# EAGLE schematic ickenham (EAGLE 9.6.2)

## Sheet 1 of 6: USB host controller
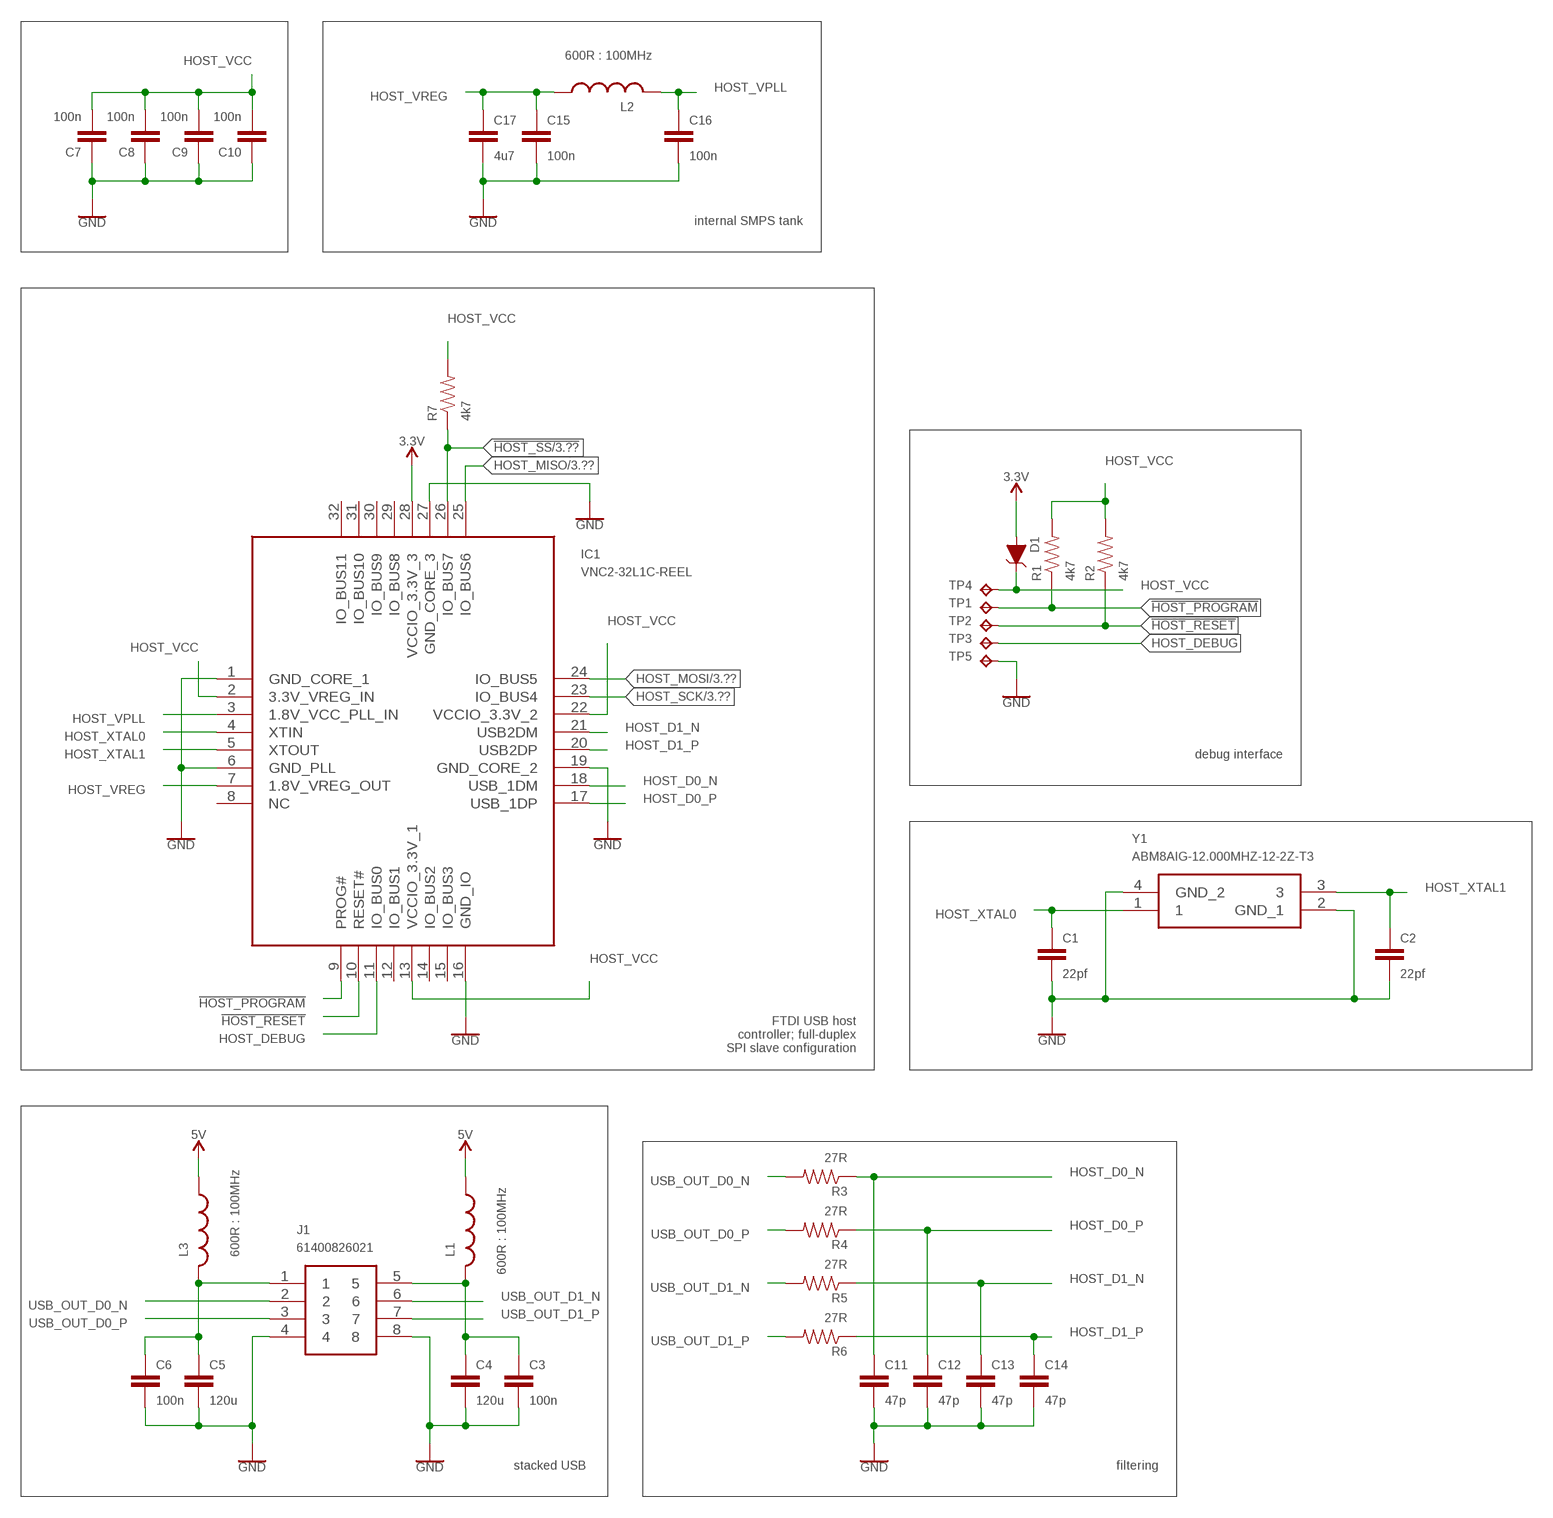
[diagram p0: schematic, sheet 1]

### Parts
C1  22pf  C-EUC0402  [C0402]
C2  22pf  C-EUC0402  [C0402]
C3  100n  CAP0402-CAP  [0402-CAP]
C4  120u  CAP0805  [0805]
C5  120u  CAP0805  [0805]
C6  100n  CAP0402-CAP  [0402-CAP]
C7  100n  C-EUC0402  [C0402]
C8  100n  C-EUC0402  [C0402]
C9  100n  C-EUC0402  [C0402]
C10  100n  C-EUC0402  [C0402]
C11  47p  CAP0402-CAP  [0402-CAP]
C12  47p  CAP0402-CAP  [0402-CAP]
C13  47p  CAP0402-CAP  [0402-CAP]
C14  47p  CAP0402-CAP  [0402-CAP]
C15  100n  CAP0402-CAP  [0402-CAP]
C16  100n  CAP0402-CAP  [0402-CAP]
C17  4u7  CAP0805  [0805]
D1  3.6V  DIODE-ZENER-BZT52C3V6S  [SOD-323]
IC1  VNC2-32L1C-REEL  [QFP80P900X900X160-32N]
J1  61400826021  [DUAL_USB_2.0_TYPE-A]
L1  600R : 100MHz  INDUCTOR0805  [0805]
L2  600R : 100MHz  INDUCTOR0805  [0805]
L3  600R : 100MHz  INDUCTOR0805  [0805]
R1  4k7  RESISTOR0402-RES  [0402-RES]
R2  4k7  RESISTOR0402-RES  [0402-RES]
R3  27R  RESISTOR0805-RES  [0805]
R4  27R  RESISTOR0805-RES  [0805]
R5  27R  RESISTOR0805-RES  [0805]
R6  27R  RESISTOR0805-RES  [0805]
R7  4k7  RESISTOR0402-RES  [0402-RES]
TP1  TPTP10R  [TP10R]
TP2  TPTP10R  [TP10R]
TP3  TPTP10R  [TP10R]
TP4  TPTP10SQ  [TP10SQ]
TP5  TPTP10R  [TP10R]
Y1  ABM8AIG-12.000MHZ-12-2Z-T3  [ABM8AIG25000MHZ122ZT3]

### Nets
3.3V: D1.A IC1.28(VCCIO_3.3V_3) ; also sheet 2,3,4,5,6
5V: L1.1 L3.1 ; also sheet 2,5
!HOST_PROGRAM: IC1.9(PROG#) R1.1 TP1.TP
!HOST_RESET: IC1.10(RESET#) R2.1 TP2.TP
!HOST_SS: IC1.26(IO_BUS7) R7.1 ; also sheet 3
GND: C1.2 C2.2 C3.2 C4.2 C5.2 C6.2 C7.1 C8.1 C9.1 C10.1 C11.2 C12.2 C13.2 C14.2 C15.2 C16.2 C17.2 IC1.1(GND_CORE_1) IC1.6(GND_PLL) IC1.16(GND_IO) IC1.19(GND_CORE_2) IC1.27(GND_CORE_3) J1.4 J1.8 TP5.TP Y1.2(GND_1) Y1.4(GND_2) ; also sheet 2,3,4,5,6
HOST_D0_N: C11.1 IC1.18(USB_1DM) R3.1
HOST_D0_P: C12.1 IC1.17(USB_1DP) R4.1
HOST_D1_N: C13.1 IC1.21(USB2DM) R5.1
HOST_D1_P: C14.1 IC1.20(USB2DP) R6.1
HOST_DEBUG: IC1.11(IO_BUS0) TP3.TP
HOST_MISO: IC1.25(IO_BUS6) ; also sheet 3
HOST_MOSI: IC1.24(IO_BUS5) ; also sheet 3
HOST_SCK: IC1.23(IO_BUS4) ; also sheet 3
HOST_VCC: C7.2 C8.2 C9.2 C10.2 D1.C IC1.2(3.3V_VREG_IN) IC1.13(VCCIO_3.3V_1) IC1.22(VCCIO_3.3V_2) R1.2 R2.2 R7.2 TP4.TP
HOST_VPLL: C16.1 IC1.3(1.8V_VCC_PLL_IN) L2.2
HOST_VREG: C15.1 C17.1 IC1.7(1.8V_VREG_OUT) L2.1
HOST_XTAL0: C1.1 IC1.4(XTIN) Y1.1
HOST_XTAL1: C2.1 IC1.5(XTOUT) Y1.3
USB0_VCC: C5.1 C6.1 J1.1 L3.2
USB1_VCC: C3.1 C4.1 J1.5 L1.2
USB_OUT_D0_N: J1.2 R3.2
USB_OUT_D0_P: J1.3 R4.2
USB_OUT_D1_N: J1.6 R5.2
USB_OUT_D1_P: J1.7 R6.2
Unconnected: IC1.8(NC) IC1.12(IO_BUS1) IC1.14(IO_BUS2) IC1.15(IO_BUS3) IC1.29(IO_BUS8) IC1.30(IO_BUS9) IC1.31(IO_BUS10) IC1.32(IO_BUS11)

### Notes on the sheet
- internal SMPS tank
- debug interface
- FTDI USB host
  controller; full-duplex
  SPI slave configuration
- stacked USB | filtering

## Sheet 2 of 6: HDMI source controller
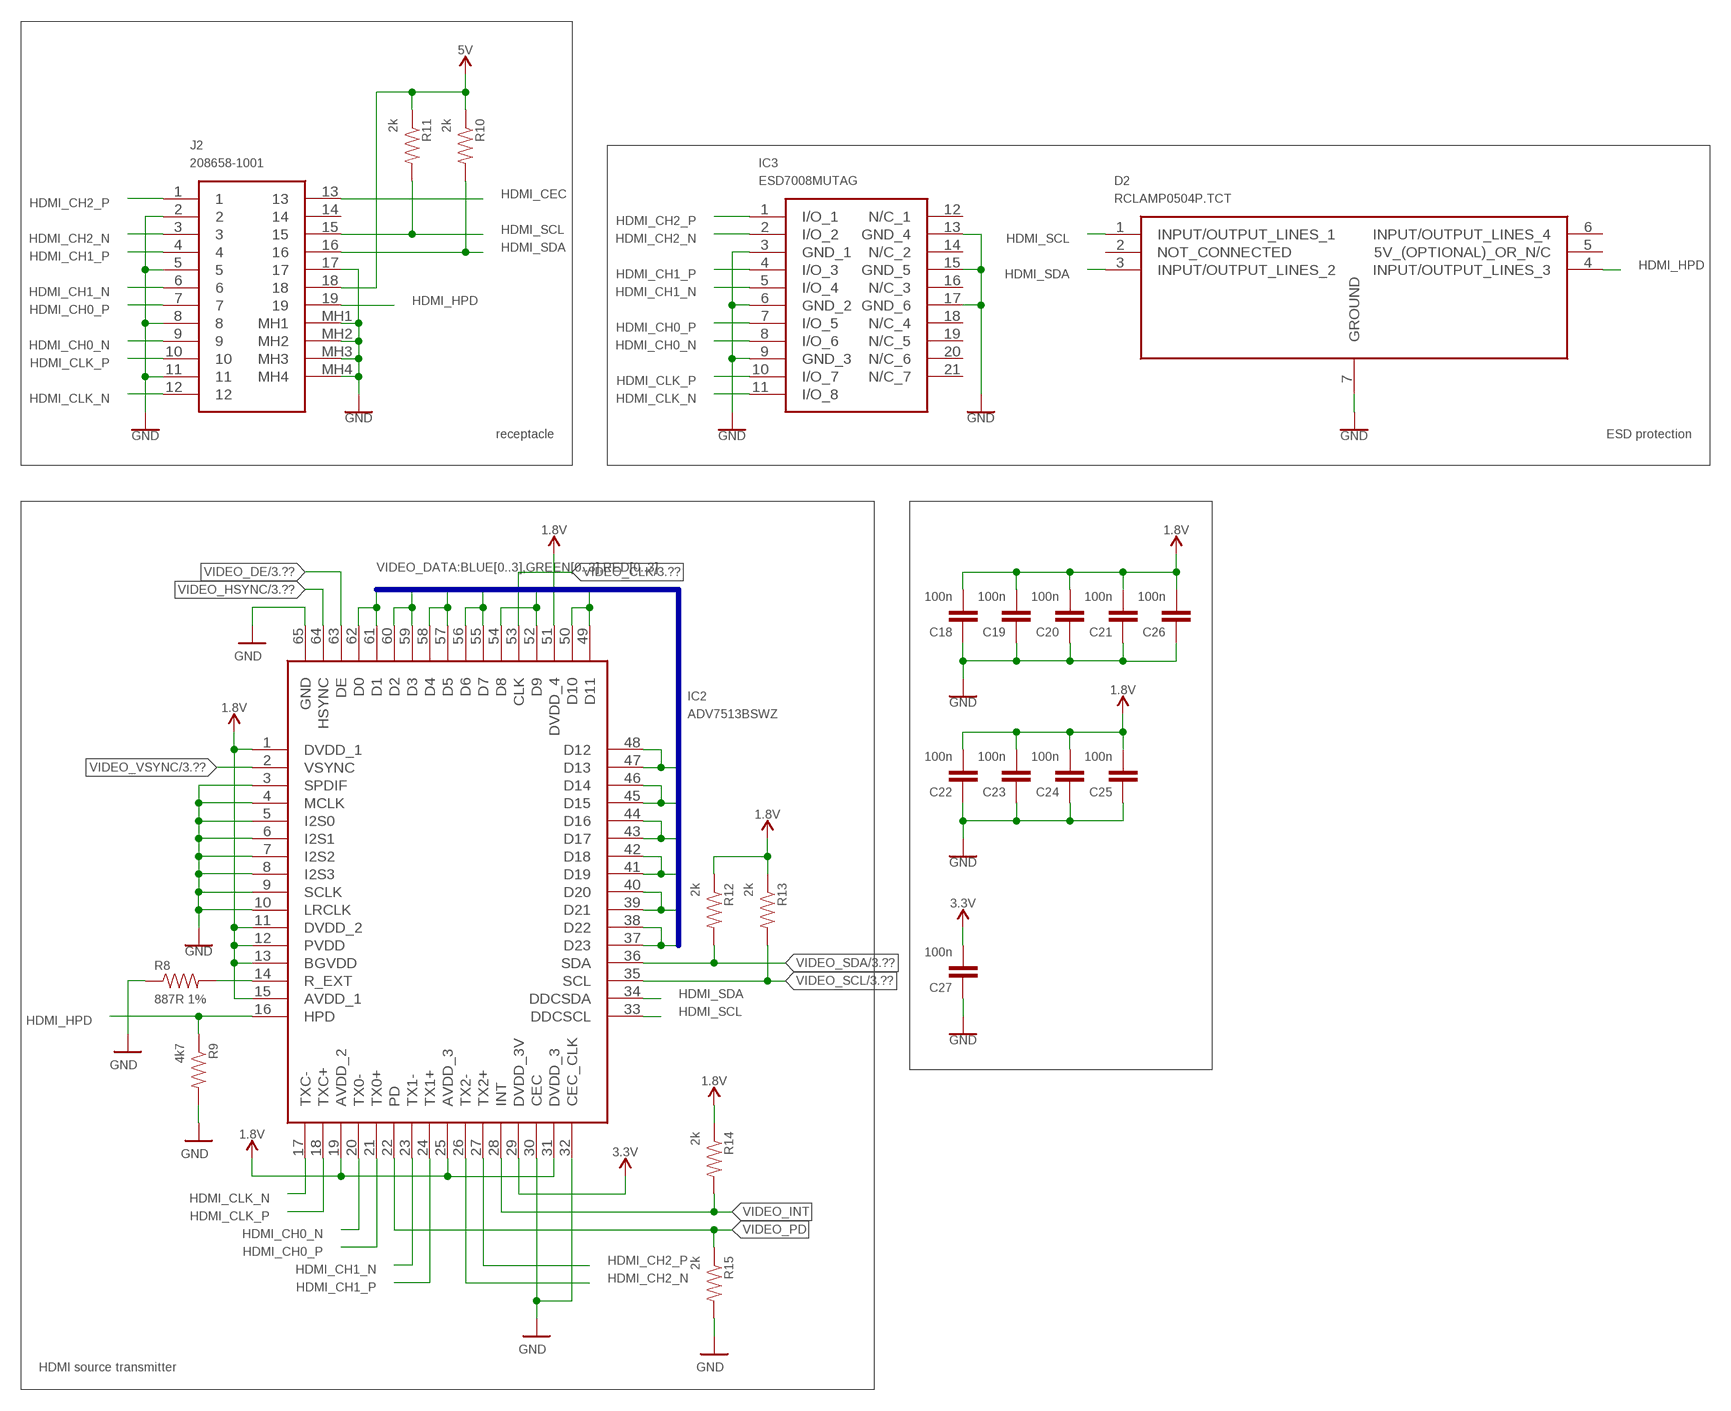
[diagram p1: schematic, sheet 2]

### Parts
C18  100n  C-EUC0402  [C0402]
C19  100n  C-EUC0402  [C0402]
C20  100n  C-EUC0402  [C0402]
C21  100n  C-EUC0402  [C0402]
C22  100n  C-EUC0402  [C0402]
C23  100n  C-EUC0402  [C0402]
C24  100n  C-EUC0402  [C0402]
C25  100n  C-EUC0402  [C0402]
C26  100n  C-EUC0402  [C0402]
C27  100n  C-EUC0402  [C0402]
D2  RCLAMP0504P.TCT  [SON50P160X160X65-7N]
IC2  ADV7513BSWZ  [QFP50P1200X1200X160-65N]
IC3  ESD7008MUTAG  [ESD7008MUTAG]
J2  208658-1001  [2086581001]
R8  887R 1%  RESISTOR0805-RES  [0805]
R9  4k7  RESISTOR0402-RES  [0402-RES]
R10  2k  RESISTOR0402-RES  [0402-RES]
R11  2k  RESISTOR0402-RES  [0402-RES]
R12  2k  RESISTOR0402-RES  [0402-RES]
R13  2k  RESISTOR0402-RES  [0402-RES]
R14  2k  RESISTOR0402-RES  [0402-RES]
R15  2k  RESISTOR0402-RES  [0402-RES]

### Nets
1.8V: C18.2 C19.2 C20.2 C21.2 C22.2 C23.2 C24.2 C25.2 C26.2 IC2.1(DVDD_1) IC2.11(DVDD_2) IC2.12(PVDD) IC2.13(BGVDD) IC2.15(AVDD_1) IC2.19(AVDD_2) IC2.25(AVDD_3) IC2.31(DVDD_3) IC2.51(DVDD_4) R12.1 R13.1 R14.1
3.3V: C27.2 IC2.29(DVDD_3V) ; also sheet 1,3,4,5,6
5V: J2.18 R10.1 R11.1 ; also sheet 1,5
GND: C18.1 C19.1 C20.1 C21.1 C22.1 C23.1 C24.1 C25.1 C26.1 C27.1 D2.7(GROUND) IC2.3(SPDIF) IC2.4(MCLK) IC2.5(I2S0) IC2.6(I2S1) IC2.7(I2S2) IC2.8(I2S3) IC2.9(SCLK) IC2.10(LRCLK) IC2.30(CEC) IC2.32(CEC_CLK) IC2.65(GND) IC3.3(GND_1) IC3.6(GND_2) IC3.9(GND_3) IC3.13(GND_4) IC3.15(GND_5) IC3.17(GND_6) J2.2 J2.5 J2.8 J2.11 J2.17 J2.MH1 J2.MH2 J2.MH3 J2.MH4 R8.1 R9.2 R15.2 ; also sheet 1,3,4,5,6
HDMI_CEC: J2.13
HDMI_CH0_N: IC2.20(TX0-) IC3.8(I/O_6) J2.9
HDMI_CH0_P: IC2.21(TX0+) IC3.7(I/O_5) J2.7
HDMI_CH1_N: IC2.23(TX1-) IC3.5(I/O_4) J2.6
HDMI_CH1_P: IC2.24(TX1+) IC3.4(I/O_3) J2.4
HDMI_CH2_N: IC2.26(TX2-) IC3.2(I/O_2) J2.3
HDMI_CH2_P: IC2.27(TX2+) IC3.1(I/O_1) J2.1
HDMI_CLK_N: IC2.17(TXC-) IC3.11(I/O_8) J2.12
HDMI_CLK_P: IC2.18(TXC+) IC3.10(I/O_7) J2.10
HDMI_HPD: D2.4(INPUT/OUTPUT_LINES_3) IC2.16(HPD) J2.19 R9.1
HDMI_SCL: D2.1(INPUT/OUTPUT_LINES_1) IC2.33(DDCSCL) J2.15 R11.2
HDMI_SDA: D2.3(INPUT/OUTPUT_LINES_2) IC2.34(DDCSDA) J2.16 R10.2
N$4: IC2.14(R_EXT) R8.2
VIDEO_BLUE0: IC2.61(D1) IC2.62(D0) ; also sheet 3
VIDEO_BLUE1: IC2.59(D3) IC2.60(D2) ; also sheet 3
VIDEO_BLUE2: IC2.57(D5) IC2.58(D4) ; also sheet 3
VIDEO_BLUE3: IC2.55(D7) IC2.56(D6) ; also sheet 3
VIDEO_CLK: IC2.53(CLK) ; also sheet 3
VIDEO_DE: IC2.63(DE) ; also sheet 3
VIDEO_GREEN0: IC2.52(D9) IC2.54(D8) ; also sheet 3
VIDEO_GREEN1: IC2.49(D11) IC2.50(D10) ; also sheet 3
VIDEO_GREEN2: IC2.47(D13) IC2.48(D12) ; also sheet 3
VIDEO_GREEN3: IC2.45(D15) IC2.46(D14) ; also sheet 3
VIDEO_HSYNC: IC2.64(HSYNC) ; also sheet 3
VIDEO_INT: IC2.28(INT) R14.2
VIDEO_PD: IC2.22(PD) R15.1
VIDEO_RED0: IC2.43(D17) IC2.44(D16) ; also sheet 3
VIDEO_RED1: IC2.41(D19) IC2.42(D18) ; also sheet 3
VIDEO_RED2: IC2.39(D21) IC2.40(D20) ; also sheet 3
VIDEO_RED3: IC2.37(D23) IC2.38(D22) ; also sheet 3
VIDEO_SCL: IC2.35(SCL) R13.2 ; also sheet 3
VIDEO_SDA: IC2.36(SDA) R12.2 ; also sheet 3
VIDEO_VSYNC: IC2.2(VSYNC) ; also sheet 3
Unconnected: D2.2(NOT_CONNECTED) D2.5(5V_(OPTIONAL)_OR_N/C) D2.6(INPUT/OUTPUT_LINES_4) IC3.12(N/C_1) IC3.14(N/C_2) IC3.16(N/C_3) IC3.18(N/C_4) IC3.19(N/C_5) IC3.20(N/C_6) IC3.21(N/C_7) J2.14

### Buses
VIDEO_DATA:BLUE[0..3],GREEN[0..3],RED[0..3]

### Notes on the sheet
- receptacle | ESD protection
- HDMI source transmitter

## Sheet 3 of 6: FPGA
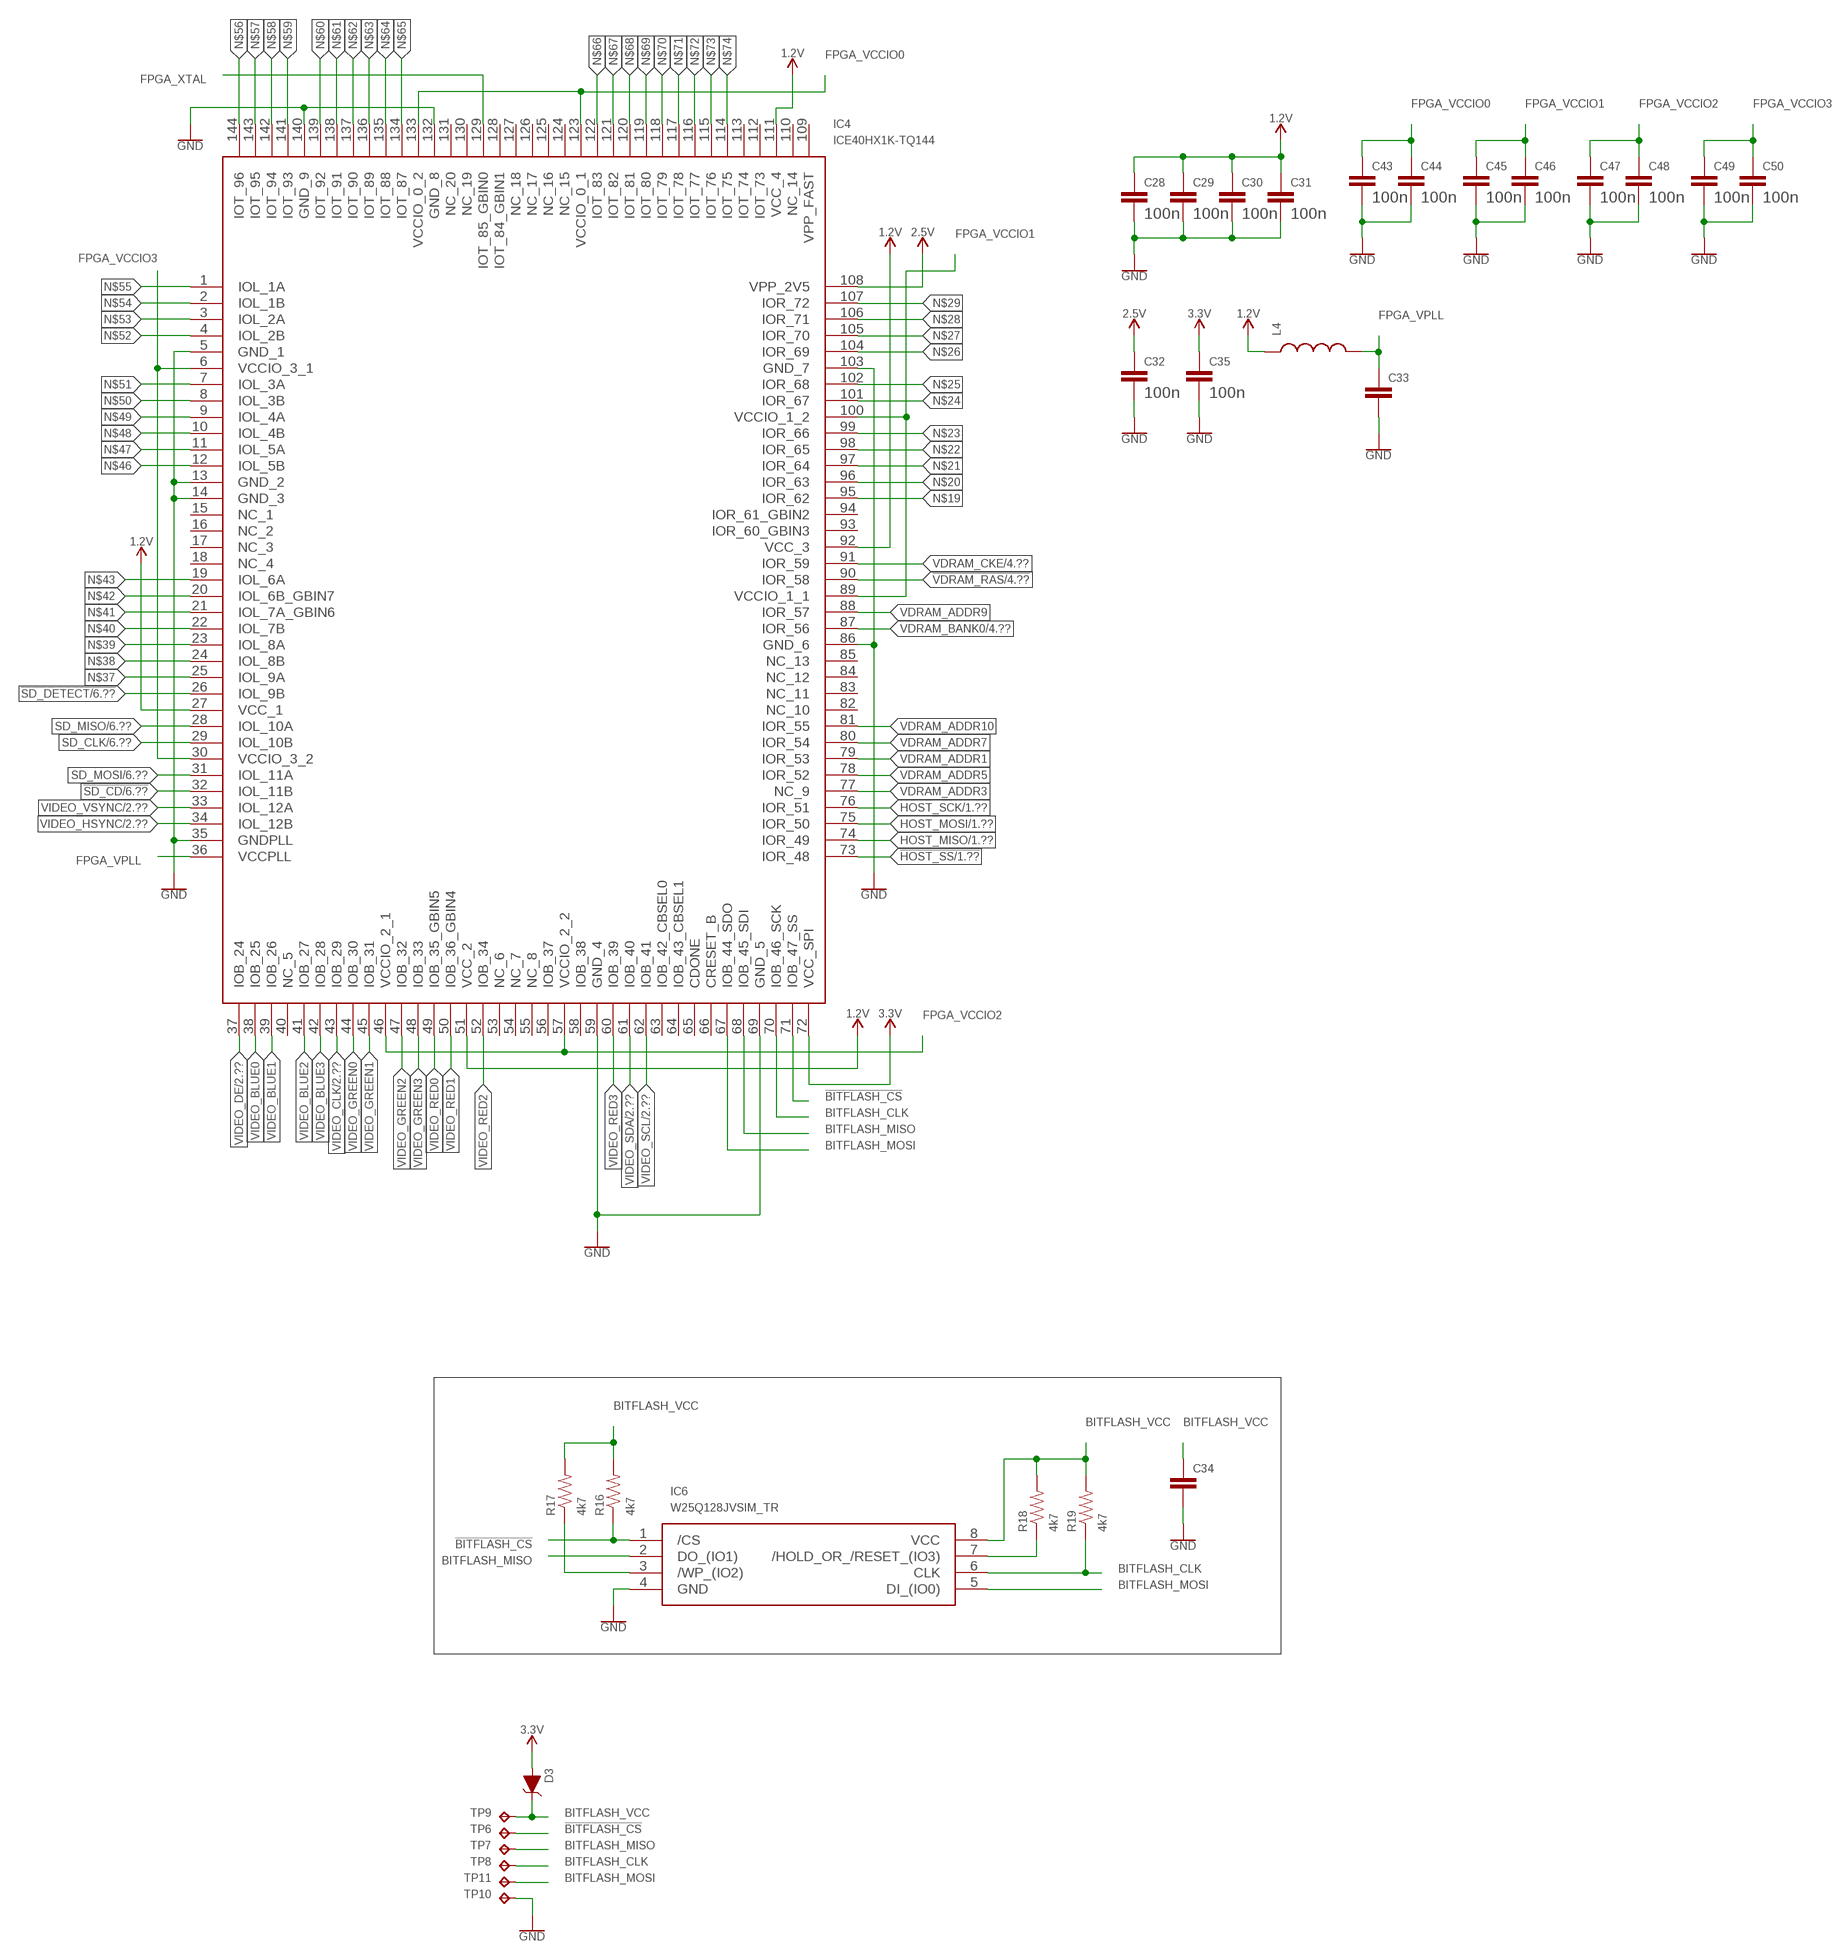
[diagram p2: schematic, sheet 3]

### Parts
C28  100n  CAP0402-CAP  [0402-CAP]
C29  100n  CAP0402-CAP  [0402-CAP]
C30  100n  CAP0402-CAP  [0402-CAP]
C31  100n  CAP0402-CAP  [0402-CAP]
C32  100n  CAP0402-CAP  [0402-CAP]
C33  CAP0402-CAP  [0402-CAP]
C34  CAP0402-CAP  [0402-CAP]
C35  100n  CAP0402-CAP  [0402-CAP]
C43  100n  CAP0402-CAP  [0402-CAP]
C44  100n  CAP0402-CAP  [0402-CAP]
C45  100n  CAP0402-CAP  [0402-CAP]
C46  100n  CAP0402-CAP  [0402-CAP]
C47  100n  CAP0402-CAP  [0402-CAP]
C48  100n  CAP0402-CAP  [0402-CAP]
C49  100n  CAP0402-CAP  [0402-CAP]
C50  100n  CAP0402-CAP  [0402-CAP]
D3  3.6V  DIODE-ZENER-BZT52C3V6S  [SOD-323]
IC4  ICE40HX1K-TQ144  [QFP50P2200X2200X160-144N]
IC6  W25Q128JVSIM_TR  [SOIC127P790X216-8N]
L4  INDUCTOR0805  [0805]
R16  4k7  RESISTOR0402-RES  [0402-RES]
R17  4k7  RESISTOR0402-RES  [0402-RES]
R18  4k7  RESISTOR0402-RES  [0402-RES]
R19  4k7  RESISTOR0402-RES  [0402-RES]
TP6  TPTP10R  [TP10R]
TP7  TPTP10R  [TP10R]
TP8  TPTP10R  [TP10R]
TP9  TPTP10SQ  [TP10SQ]
TP10  TPTP10R  [TP10R]
TP11  TPTP10R  [TP10R]

### Nets
1.2V: C28.1 C29.1 C30.1 C31.1 IC4.27(VCC_1) IC4.51(VCC_2) IC4.92(VCC_3) IC4.111(VCC_4) L4.1
2.5V: C32.1 IC4.108(VPP_2V5)
3.3V: C35.1 D3.A IC4.72(VCC_SPI) ; also sheet 1,2,4,5,6
!BITFLASH_CS: IC4.71(IOB_47_SS) IC6.1(/CS) R16.1 TP6.TP
!HOST_SS: IC4.73(IOR_48) ; also sheet 1
!SD_CD: IC4.32(IOL_11B) ; also sheet 6
!SD_DETECT: IC4.26(IOL_9B) ; also sheet 6
!VDRAM_RAS: IC4.90(IOR_58) ; also sheet 4
BITFLASH_CLK: IC4.70(IOB_46_SCK) IC6.6(CLK) R19.1 TP8.TP
BITFLASH_MISO: IC4.68(IOB_45_SDI) IC6.2(DO_(IO1)) TP7.TP
BITFLASH_MOSI: IC4.67(IOB_44_SDO) IC6.5(DI_(IO0)) TP11.TP
BITFLASH_VCC: C34.1 D3.C IC6.8(VCC) R16.2 R17.2 R18.2 R19.2 TP9.TP
FPGA_VCCIO0: C43.1 C44.1 IC4.123(VCCIO_0_1) IC4.133(VCCIO_0_2)
FPGA_VCCIO1: C45.1 C46.1 IC4.89(VCCIO_1_1) IC4.100(VCCIO_1_2)
FPGA_VCCIO2: C47.1 C48.1 IC4.46(VCCIO_2_1) IC4.57(VCCIO_2_2)
FPGA_VCCIO3: C49.1 C50.1 IC4.6(VCCIO_3_1) IC4.30(VCCIO_3_2)
FPGA_VPLL: C33.1 IC4.36(VCCPLL) L4.2
FPGA_XTAL: IC4.129(IOT_85_GBIN0)
GND: C28.2 C29.2 C30.2 C31.2 C32.2 C33.2 C34.2 C35.2 C43.2 C44.2 C45.2 C46.2 C47.2 C48.2 C49.2 C50.2 IC4.5(GND_1) IC4.13(GND_2) IC4.14(GND_3) IC4.35(GNDPLL) IC4.59(GND_4) IC4.69(GND_5) IC4.86(GND_6) IC4.103(GND_7) IC4.132(GND_8) IC4.140(GND_9) IC6.4(GND) TP10.TP ; also sheet 1,2,4,5,6
HOST_MISO: IC4.74(IOR_49) ; also sheet 1
HOST_MOSI: IC4.75(IOR_50) ; also sheet 1
HOST_SCK: IC4.76(IOR_51) ; also sheet 1
N$9: IC6.3(/WP_(IO2)) R17.1
N$10: IC6.7(/HOLD_OR_/RESET_(IO3)) R18.1
N$19: IC4.95(IOR_62)
N$20: IC4.96(IOR_63)
N$21: IC4.97(IOR_64)
N$22: IC4.98(IOR_65)
N$23: IC4.99(IOR_66)
N$24: IC4.101(IOR_67)
N$25: IC4.102(IOR_68)
N$26: IC4.104(IOR_69)
N$27: IC4.105(IOR_70)
N$28: IC4.106(IOR_71)
N$29: IC4.107(IOR_72)
N$37: IC4.25(IOL_9A)
N$38: IC4.24(IOL_8B)
N$39: IC4.23(IOL_8A)
N$40: IC4.22(IOL_7B)
N$41: IC4.21(IOL_7A_GBIN6)
N$42: IC4.20(IOL_6B_GBIN7)
N$43: IC4.19(IOL_6A)
N$46: IC4.12(IOL_5B)
N$47: IC4.11(IOL_5A)
N$48: IC4.10(IOL_4B)
N$49: IC4.9(IOL_4A)
N$50: IC4.8(IOL_3B)
N$51: IC4.7(IOL_3A)
N$52: IC4.4(IOL_2B)
N$53: IC4.3(IOL_2A)
N$54: IC4.2(IOL_1B)
N$55: IC4.1(IOL_1A)
N$56: IC4.144(IOT_96)
N$57: IC4.143(IOT_95)
N$58: IC4.142(IOT_94)
N$59: IC4.141(IOT_93)
N$60: IC4.139(IOT_92)
N$61: IC4.138(IOT_91)
N$62: IC4.137(IOT_90)
N$63: IC4.136(IOT_89)
N$64: IC4.135(IOT_88)
N$65: IC4.134(IOT_87)
N$66: IC4.122(IOT_83)
N$67: IC4.121(IOT_82)
N$68: IC4.120(IOT_81)
N$69: IC4.119(IOT_80)
N$70: IC4.118(IOT_79)
N$71: IC4.117(IOT_78)
N$72: IC4.116(IOT_77)
N$73: IC4.115(IOT_76)
N$74: IC4.114(IOT_75)
SD_CLK: IC4.29(IOL_10B) ; also sheet 6
SD_MISO: IC4.28(IOL_10A) ; also sheet 6
SD_MOSI: IC4.31(IOL_11A) ; also sheet 6
VDRAM_ADDR1: IC4.79(IOR_53) ; also sheet 4
VDRAM_ADDR3: IC4.77(NC_9) ; also sheet 4
VDRAM_ADDR5: IC4.78(IOR_52) ; also sheet 4
VDRAM_ADDR7: IC4.80(IOR_54) ; also sheet 4
VDRAM_ADDR9: IC4.88(IOR_57) ; also sheet 4
VDRAM_ADDR10: IC4.81(IOR_55) ; also sheet 4
VDRAM_BANK0: IC4.87(IOR_56) ; also sheet 4
VDRAM_CKE: IC4.91(IOR_59) ; also sheet 4
VIDEO_BLUE0: IC4.38(IOB_25) ; also sheet 2
VIDEO_BLUE1: IC4.39(IOB_26) ; also sheet 2
VIDEO_BLUE2: IC4.41(IOB_27) ; also sheet 2
VIDEO_BLUE3: IC4.42(IOB_28) ; also sheet 2
VIDEO_CLK: IC4.43(IOB_29) ; also sheet 2
VIDEO_DE: IC4.37(IOB_24) ; also sheet 2
VIDEO_GREEN0: IC4.44(IOB_30) ; also sheet 2
VIDEO_GREEN1: IC4.45(IOB_31) ; also sheet 2
VIDEO_GREEN2: IC4.47(IOB_32) ; also sheet 2
VIDEO_GREEN3: IC4.48(IOB_33) ; also sheet 2
VIDEO_HSYNC: IC4.34(IOL_12B) ; also sheet 2
VIDEO_RED0: IC4.49(IOB_35_GBIN5) ; also sheet 2
VIDEO_RED1: IC4.50(IOB_36_GBIN4) ; also sheet 2
VIDEO_RED2: IC4.52(IOB_34) ; also sheet 2
VIDEO_RED3: IC4.60(IOB_39) ; also sheet 2
VIDEO_SCL: IC4.62(IOB_41) ; also sheet 2
VIDEO_SDA: IC4.61(IOB_40) ; also sheet 2
VIDEO_VSYNC: IC4.33(IOL_12A) ; also sheet 2
Unconnected: IC4.15(NC_1) IC4.16(NC_2) IC4.17(NC_3) IC4.18(NC_4) IC4.40(NC_5) IC4.53(NC_6) IC4.54(NC_7) IC4.55(NC_8) IC4.56(IOB_37) IC4.58(IOB_38) IC4.63(IOB_42_CBSEL0) IC4.64(IOB_43_CBSEL1) IC4.65(CDONE) IC4.66(CRESET_B) IC4.82(NC_10) IC4.83(NC_11) IC4.84(NC_12) IC4.85(NC_13) IC4.93(IOR_60_GBIN3) IC4.94(IOR_61_GBIN2) IC4.109(VPP_FAST) IC4.110(NC_14) IC4.112(IOT_73) IC4.113(IOT_74) IC4.124(NC_15) IC4.125(NC_16) IC4.126(NC_17) IC4.127(NC_18) IC4.128(IOT_84_GBIN1) IC4.130(NC_19) IC4.131(NC_20)

## Sheet 4 of 6: DRAM
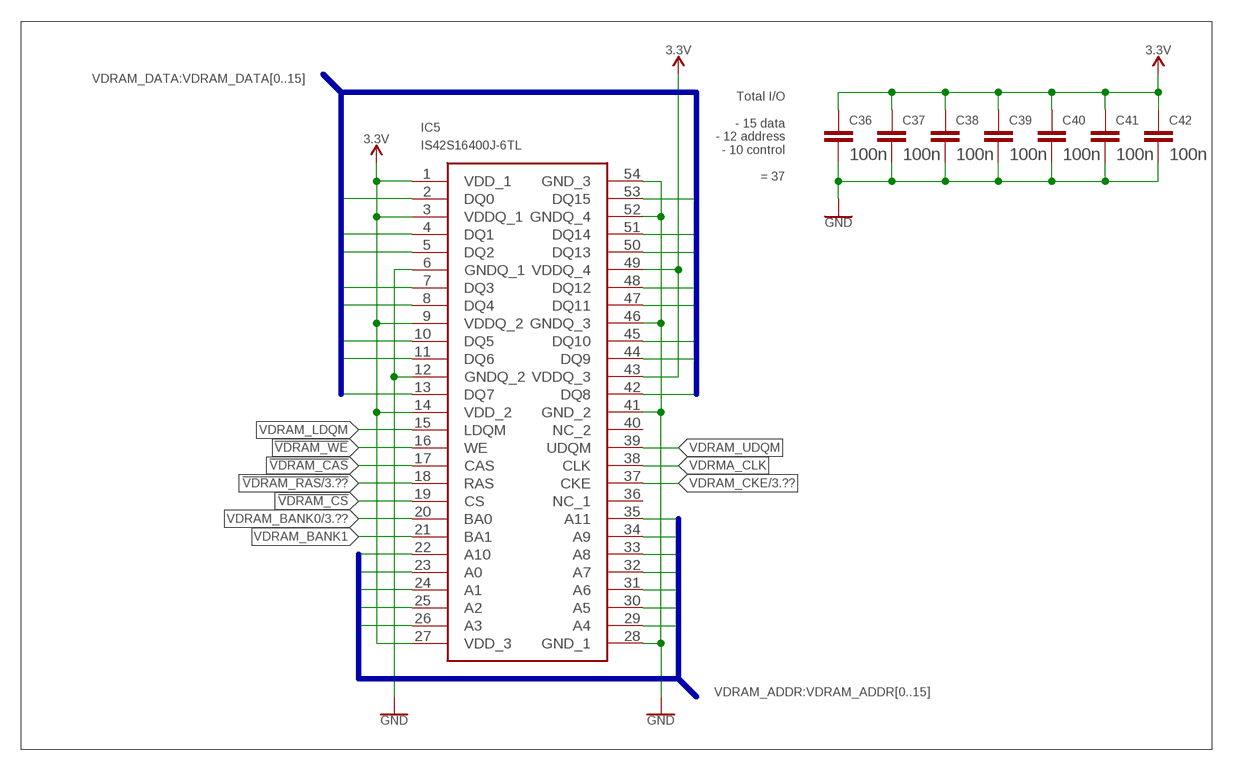
[diagram p3: schematic, sheet 4]

### Parts
C36  100n  CAP0402-CAP  [0402-CAP]
C37  100n  CAP0402-CAP  [0402-CAP]
C38  100n  CAP0402-CAP  [0402-CAP]
C39  100n  CAP0402-CAP  [0402-CAP]
C40  100n  CAP0402-CAP  [0402-CAP]
C41  100n  CAP0402-CAP  [0402-CAP]
C42  100n  CAP0402-CAP  [0402-CAP]
IC5  IS42S16400J-6TL  [SOP80P1176X120-54N]

### Nets
3.3V: C36.1 C37.1 C38.1 C39.1 C40.1 C41.1 C42.1 IC5.1(VDD_1) IC5.3(VDDQ_1) IC5.9(VDDQ_2) IC5.14(VDD_2) IC5.27(VDD_3) IC5.43(VDDQ_3) IC5.49(VDDQ_4) ; also sheet 1,2,3,5,6
!VDRAM_CAS: IC5.17(CAS)
!VDRAM_CS: IC5.19(CS)
!VDRAM_RAS: IC5.18(RAS) ; also sheet 3
!VDRAM_WE: IC5.16(WE)
GND: C36.2 C37.2 C38.2 C39.2 C40.2 C41.2 C42.2 IC5.6(GNDQ_1) IC5.12(GNDQ_2) IC5.28(GND_1) IC5.41(GND_2) IC5.46(GNDQ_3) IC5.52(GNDQ_4) IC5.54(GND_3) ; also sheet 1,2,3,5,6
VDRAM_ADDR0: IC5.23(A0)
VDRAM_ADDR1: IC5.24(A1) ; also sheet 3
VDRAM_ADDR2: IC5.25(A2)
VDRAM_ADDR3: IC5.26(A3) ; also sheet 3
VDRAM_ADDR4: IC5.29(A4)
VDRAM_ADDR5: IC5.30(A5) ; also sheet 3
VDRAM_ADDR6: IC5.31(A6)
VDRAM_ADDR7: IC5.32(A7) ; also sheet 3
VDRAM_ADDR8: IC5.33(A8)
VDRAM_ADDR9: IC5.34(A9) ; also sheet 3
VDRAM_ADDR10: IC5.22(A10) ; also sheet 3
VDRAM_ADDR11: IC5.35(A11)
VDRAM_BANK0: IC5.20(BA0) ; also sheet 3
VDRAM_BANK1: IC5.21(BA1)
VDRAM_CKE: IC5.37(CKE) ; also sheet 3
VDRAM_DATA0: IC5.2(DQ0)
VDRAM_DATA1: IC5.4(DQ1)
VDRAM_DATA2: IC5.5(DQ2)
VDRAM_DATA3: IC5.7(DQ3)
VDRAM_DATA4: IC5.8(DQ4)
VDRAM_DATA5: IC5.10(DQ5)
VDRAM_DATA6: IC5.11(DQ6)
VDRAM_DATA7: IC5.13(DQ7)
VDRAM_DATA8: IC5.42(DQ8)
VDRAM_DATA9: IC5.44(DQ9)
VDRAM_DATA10: IC5.45(DQ10)
VDRAM_DATA11: IC5.47(DQ11)
VDRAM_DATA12: IC5.48(DQ12)
VDRAM_DATA13: IC5.50(DQ13)
VDRAM_DATA14: IC5.51(DQ14)
VDRAM_DATA15: IC5.53(DQ15)
VDRAM_LDQM: IC5.15(LDQM)
VDRAM_UDQM: IC5.39(UDQM)
VDRMA_CLK: IC5.38(CLK)
Unconnected: IC5.36(NC_1) IC5.40(NC_2)

### Buses
VDRAM_DATA:VDRAM_DATA[0..15]
VDRAM_ADDR:VDRAM_ADDR[0..15]

### Notes on the sheet
- Total I/O
  
  - 15 data
  - 12 address
  - 10 control
  
  = 37

## Sheet 5 of 6: Power
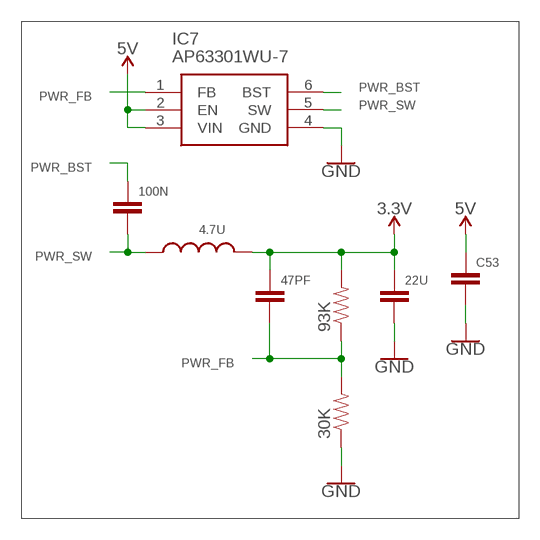
[diagram p4: schematic, sheet 5]

### Parts
4.7U  INDUCTOR1210  [1210]
22U  CAP1206  [1206]
30K  RESISTOR0402-RES  [0402-RES]
47PF  CAP0402-CAP  [0402-CAP]
93K  RESISTOR0402-RES  [0402-RES]
100N  CAP0402-CAP  [0402-CAP]
C53  CAP1206  [1206]
IC7  AP63301WU-7  [SOT95P280X100-6N]

### Nets
3.3V: 4.7U.2 22U.1 47PF.1 93K.2 ; also sheet 1,2,3,4,6
5V: C53.1 IC7.2(EN) IC7.3(VIN) ; also sheet 1,2
GND: 22U.2 30K.1 C53.2 IC7.4(GND) ; also sheet 1,2,3,4,6
PWR_BST: 100N.1 IC7.6(BST)
PWR_FB: 30K.2 47PF.2 93K.1 IC7.1(FB)
PWR_SW: 4.7U.1 100N.2 IC7.5(SW)

## Sheet 6 of 6: Memory
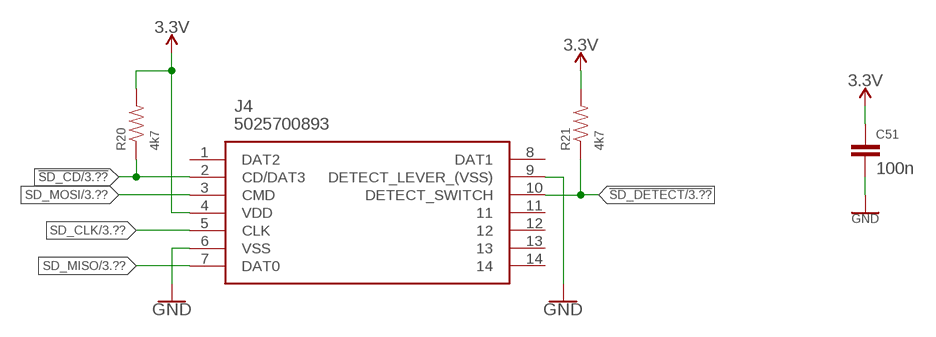
[diagram p5: schematic, sheet 6]

### Parts
C51  100n  CAP0402-CAP  [0402-CAP]
J4  5025700893  [5025700893]
R20  4k7  RESISTOR0402-RES  [0402-RES]
R21  4k7  RESISTOR0402-RES  [0402-RES]

### Nets
3.3V: C51.1 J4.4(VDD) R20.2 R21.2 ; also sheet 1,2,3,4,5
!SD_CD: J4.2(CD/DAT3) R20.1 ; also sheet 3
!SD_DETECT: J4.10(DETECT_SWITCH) R21.1 ; also sheet 3
GND: C51.2 J4.6(VSS) J4.9(DETECT_LEVER_(VSS)) ; also sheet 1,2,3,4,5
SD_CLK: J4.5(CLK) ; also sheet 3
SD_MISO: J4.7(DAT0) ; also sheet 3
SD_MOSI: J4.3(CMD) ; also sheet 3
Unconnected: J4.1(DAT2) J4.8(DAT1) J4.11 J4.12 J4.13 J4.14

## Library data of the parts
4.7U L1-L4 = passives:INDUCTOR: Inductors Basic Inductor/Choke - 0603 and 1206. Footprints are not proven and vary greatly between part numbers.
22U 47PF 100N C3-C6 C11-C17 C28-C51 C53 = passives:CAP: Capacitor Standard 0603 ceramic capacitor, and 0.1" leaded capacitor.
30K 93K R1-R21 = resistors:RESISTOR: Resistor Basic schematic elements and footprints for 0603, 1206, and PTH resistors.
C1 C2 C7-C10 C18-C27 = rcl:C-EU: CAPACITOR, European symbol; SPICEPREFIX: C
D1 D3 = discrete:DIODE-ZENER: Zener Diode A Zener diode allows current to flow from its anode to its cathode like a normal semiconductor diode, but it also permits current to flow in the reverse direction when its "Zener voltage" is reached. - WIkipedia; PROD_ID: DIO-08199
D2 = semtech-quad-clamp-tvs-RCLAMP0504P.TCT:RCLAMP0504P.TCT: RailClamp Low-Capacitance TVS Array Semtech RCLAMP0504P.TCT, Quad Uni-Directional TVS Diode Array, 150W, 6-Pin SLP EP Source: Datasheet <https://datasheet.datasheetarchive.com/originals/distributors/Datasheets-30/DSA-588587.pdf>; ARROW_PART_NUMBER: RCLAMP0504P.TCT; ARROW_PRICE-STOCK: https://www.arrow.com/en/products/rclamp0504p.tct/semtech; DESCRIPTION: RailClamp Low-Capacitance TVS Array Semtech RCLAMP0504P.TCT, Quad Uni-Directional TVS Diode Array, 150W, 6-Pin SLP EP; HEIGHT: 0.65mm; MANUFACTURER_NAME: SEMTECH; MANUFACTURER_PART_NUMBER: RCLAMP0504P.TCT; MOUSER_PART_NUMBER: 947-RCLAMP0504P.TCT; MOUSER_PRICE-STOCK: https://www.mouser.co.uk/ProductDetail/Semtech/RCLAMP0504P.TCT?qs=rBWM4%252BvDhIcENW0v60uWhA%3D%3D
IC1 = ftdi-usb-host-controller-VNC2-32L1C-REEL:VNC2-32L1C-REEL: FTDI - VNC2-32L1C-REEL - CONTROLLER, USB, VINCULUM II, 32LQFP Source: Datasheet <https://componentsearchengine.com/Datasheets/1/VNC2-32L1C-REEL.pdf>; ARROW_PART_NUMBER: VNC2-32L1C-REEL; ARROW_PRICE-STOCK: https://www.arrow.com/en/products/vnc2-32l1c-reel/ftdi-chip?region=nac; DESCRIPTION: FTDI - VNC2-32L1C-REEL - CONTROLLER, USB, VINCULUM II, 32LQFP; HEIGHT: 1.6mm; MANUFACTURER_NAME: FTDI Chip; MANUFACTURER_PART_NUMBER: VNC2-32L1C-REEL; MOUSER_PART_NUMBER: 895-VNC2-32L1C-REEL; MOUSER_PRICE-STOCK: https://www.mouser.co.uk/ProductDetail/FTDI/VNC2-32L1C-REEL?qs=kxHH85wvK2JYNGC4CH%252BL2w%3D%3D
IC2 = analog-devices-hdmi-transmitter-ADV7513BSWZ:ADV7513BSWZ: Analog Devices, ADV7513BSWZ ADV7513BSWZ, HDMI Transmitter for DDR, HDMI, ITU656, RGB, SPDIF Stereo LPCM, YCbCr, 8-channel, 64-Pin LQFP Source: Datasheet <https://componentsearchengine.com/Datasheets/2/ADV7513BSWZ.pdf>; ARROW_PART_NUMBER: ADV7513BSWZ; ARROW_PRICE-STOCK: https://www.arrow.com/en/products/adv7513bswz/analog-devices?region=europe; DESCRIPTION: Analog Devices, ADV7513BSWZ ADV7513BSWZ, HDMI Transmitter for DDR, HDMI, ITU656, RGB, SPDIF Stereo LPCM, YCbCr, 8-channel, 64-Pin LQFP; HEIGHT: 1.6mm; MANUFACTURER_NAME: Analog Devices; MANUFACTURER_PART_NUMBER: ADV7513BSWZ; MOUSER_PART_NUMBER: 584-ADV7513BSWZ; MOUSER_PRICE-STOCK: https://www.mouser.co.uk/ProductDetail/Analog-Devices/ADV7513BSWZ?qs=WIvQP4zGanhTiE0U2ueahA%3D%3D
IC3 = onsemi-esd-protection-diode-ESD7008MUTAG:ESD7008MUTAG: ESD Protection Diode/002 Source: Datasheet <http://www.onsemi.com/pub/Collateral/ESD7008-D.PDF>; ARROW_PART_NUMBER: ESD7008MUTAG; ARROW_PRICE-STOCK: https://www.arrow.com/en/products/esd7008mutag/on-semiconductor?region=nac; DESCRIPTION: ESD Protection Diode/002; HEIGHT: 0.55mm; MANUFACTURER_NAME: onsemi; MANUFACTURER_PART_NUMBER: ESD7008MUTAG; MOUSER_PART_NUMBER: 863-ESD7008MUTAG; MOUSER_PRICE-STOCK: https://www.mouser.co.uk/ProductDetail/onsemi/ESD7008MUTAG?qs=Gud3nhECO%2Fs1qvAxYTTX5w%3D%3D
IC4 = lattice-fpga-ICE40HX1K-TQ144:ICE40HX1K-TQ144: FPGA iCE40 HX Family 1280 Cells 40nm Technology 1.2V 144-Pin TQFP Tray Source: Datasheet <https://datasheet.datasheetarchive.com/originals/dk/DKDS-14/263177.pdf>; DESCRIPTION: FPGA iCE40 HX Family 1280 Cells 40nm Technology 1.2V 144-Pin TQFP Tray; HEIGHT: 1.6mm; MANUFACTURER_NAME: Lattice Semiconductor; MANUFACTURER_PART_NUMBER: ICE40HX1K-TQ144; MOUSER_PART_NUMBER: 842-ICE40HX1K-TQ144; MOUSER_PRICE-STOCK: https://www.mouser.co.uk/ProductDetail/Lattice/iCE40HX1K-TQ144?qs=F9A14TELRMtiYSwGl6R%2Fcw%3D%3D
IC5 = issi-dram-64mbit-IS42S16400J-6TL:IS42S16400J-6TL: IC SDRAM 64MBIT 166MHZ 54TSOP Source: Datasheet <http://www.issi.com/WW/pdf/42-45S16400J.pdf>; ARROW_PART_NUMBER: IS42S16400J-6TL; ARROW_PRICE-STOCK: https://www.arrow.com/en/products/is42s16400j-6tl/integrated-silicon-solution-inc?region=nac; DESCRIPTION: IC SDRAM 64MBIT 166MHZ 54TSOP; HEIGHT: 1.2mm; MANUFACTURER_NAME: Integrated Silicon Solution Inc.; MANUFACTURER_PART_NUMBER: IS42S16400J-6TL; MOUSER_PART_NUMBER: 870-IS42S16400J-6TL; MOUSER_PRICE-STOCK: https://www.mouser.co.uk/ProductDetail/ISSI/IS42S16400J-6TL?qs=eOmjsnl%2FhF5I5xcs3%252ByNmg%3D%3D
IC6 = winbond-spi-flash-128mb-W25Q128JVSIM_TR:W25Q128JVSIM_TR: 3V 128M-BIT SERIAL FLASH MEMORY WITH DUAL/QUAD SPI & QPI & DTR Source: Datasheet <http://www.winbond.com/resource-files/w25q128jv dtr revb 11042016.pdf>; ARROW_PART_NUMBER: W25Q128JVSIM TR; ARROW_PRICE-STOCK: https://www.arrow.com/en/products/w25q128jvsimtr/winbond-electronics?region=nac; DESCRIPTION: 3V 128M-BIT SERIAL FLASH MEMORY WITH DUAL/QUAD SPI & QPI & DTR; HEIGHT: 2.16mm; MANUFACTURER_NAME: Winbond; MANUFACTURER_PART_NUMBER: W25Q128JVSIM TR; MOUSER_PART_NUMBER: 454-W25Q128JVSIMTR; MOUSER_PRICE-STOCK: https://www.mouser.co.uk/ProductDetail/Winbond/W25Q128JVSIM-TR?qs=qSfuJ%252Bfl%2Fd6ji9IuruL6Zg%3D%3D
IC7 = diodes-inc-3a-switching-regulator-AP63301WU-7:AP63301WU-7: 3.8V TO 32V INPUT, 3A LOW IQ SYNCHRONOUS BUCK WITH ENHANCED EMI REDUCTION. Source: Datasheet <https://www.diodes.com/assets/Datasheets/AP63300-AP63301.pdf>; ARROW_PART_NUMBER: AP63301WU-7; ARROW_PRICE-STOCK: https://www.arrow.com/en/products/ap63301wu-7/diodes-incorporated?region=nac; DESCRIPTION: 3.8V TO 32V INPUT, 3A LOW IQ SYNCHRONOUS BUCK WITH ENHANCED EMI REDUCTION.; HEIGHT: 1mm; MANUFACTURER_NAME: Diodes Inc.; MANUFACTURER_PART_NUMBER: AP63301WU-7; MOUSER_PART_NUMBER: 621-AP63301WU-7; MOUSER_PRICE-STOCK: https://www.mouser.co.uk/ProductDetail/Diodes-Incorporated/AP63301WU-7?qs=bZr6mbWTK5mxozg17S0lNg%3D%3D
J1 = wurth-usb-a-receptacle-stacked-61400826021:61400826021: Wurth Elektronik Female Straight Through Hole Type A USB Connector, 30 V, 1.5A WR-COM Source: Datasheet <https://katalog.we-online.com/em/datasheet/61400826021.pdf>; DESCRIPTION: Wurth Elektronik Female Straight Through Hole Type A USB Connector, 30 V, 1.5A WR-COM; HEIGHT: mm; MANUFACTURER_NAME: Wurth Elektronik; MANUFACTURER_PART_NUMBER: 61400826021; MOUSER_PART_NUMBER: 710-61400826021; MOUSER_PRICE-STOCK: https://www.mouser.co.uk/ProductDetail/Wurth-Elektronik/61400826021?qs=rS3zZhy2AQNRjP3Vs%2FPxTg%3D%3D
J2 = molex-hdmi-receptacle-208658-1001:208658-1001: HDMI, Displayport & DVI Connectors 0.5mm HDMI Recep RA 19CKT Source: Datasheet <https://componentsearchengine.com/Datasheets/2/208658-1001.pdf>; DESCRIPTION: HDMI, Displayport & DVI Connectors 0.5mm HDMI Recep RA 19CKT; HEIGHT: 6.19mm; MANUFACTURER_NAME: Molex; MANUFACTURER_PART_NUMBER: 208658-1001; MOUSER_PART_NUMBER: 538-208658-1001; MOUSER_PRICE-STOCK: https://www.mouser.co.uk/ProductDetail/Molex/208658-1001?qs=B6kkDfuK7%2FCPiHHdkGL5VQ%3D%3D
J4 = molex-sd-card-receptacle-5025700893:5025700893: CONN MICRO SD CARD PUSH-PUSH R/A Source: Datasheet <https://www.molex.com/pdm_docs/sd/5025700893_sd.pdf>; ARROW_PART_NUMBER: 5025700893; ARROW_PRICE-STOCK: https://www.arrow.com/en/products/5025700893/molex?region=nac; DESCRIPTION: CONN MICRO SD CARD PUSH-PUSH R/A; HEIGHT: 1mm; MANUFACTURER_NAME: Molex; MANUFACTURER_PART_NUMBER: 5025700893
TP1-TP11 = testpad:TP: Test pad
Y1 = abracon-crystal-12mhz-ABM8AIG-12.000MHZ-12-2Z-T3:ABM8AIG-12.000MHZ-12-2Z-T3: ABRACON - ABM8AIG-12.000MHZ-12-2Z-T3 - CRYSTAL, AUTO, 12MHZ, 12PF, 3.2X2.5MM Source: Datasheet <https://abracon.com/AIGcrystals/ABM8AIG.pdf>; ARROW_PART_NUMBER: ABM8AIG-12.000MHZ-12-2Z-T3; ARROW_PRICE-STOCK: https://www.arrow.com/en/products/abm8aig12.000mhz122zt3/abracon?region=nac; DESCRIPTION: ABRACON - ABM8AIG-12.000MHZ-12-2Z-T3 - CRYSTAL, AUTO, 12MHZ, 12PF, 3.2X2.5MM; HEIGHT: 0mm; MANUFACTURER_NAME: ABRACON; MANUFACTURER_PART_NUMBER: ABM8AIG-12.000MHZ-12-2Z-T3; MOUSER_PART_NUMBER: 815-M8AIG-12-12-2ZT3; MOUSER_PRICE-STOCK: https://www.mouser.co.uk/ProductDetail/ABRACON/ABM8AIG-12000MHZ-12-2Z-T3?qs=gG6m684uYP5EjaQyIprz9g%3D%3D